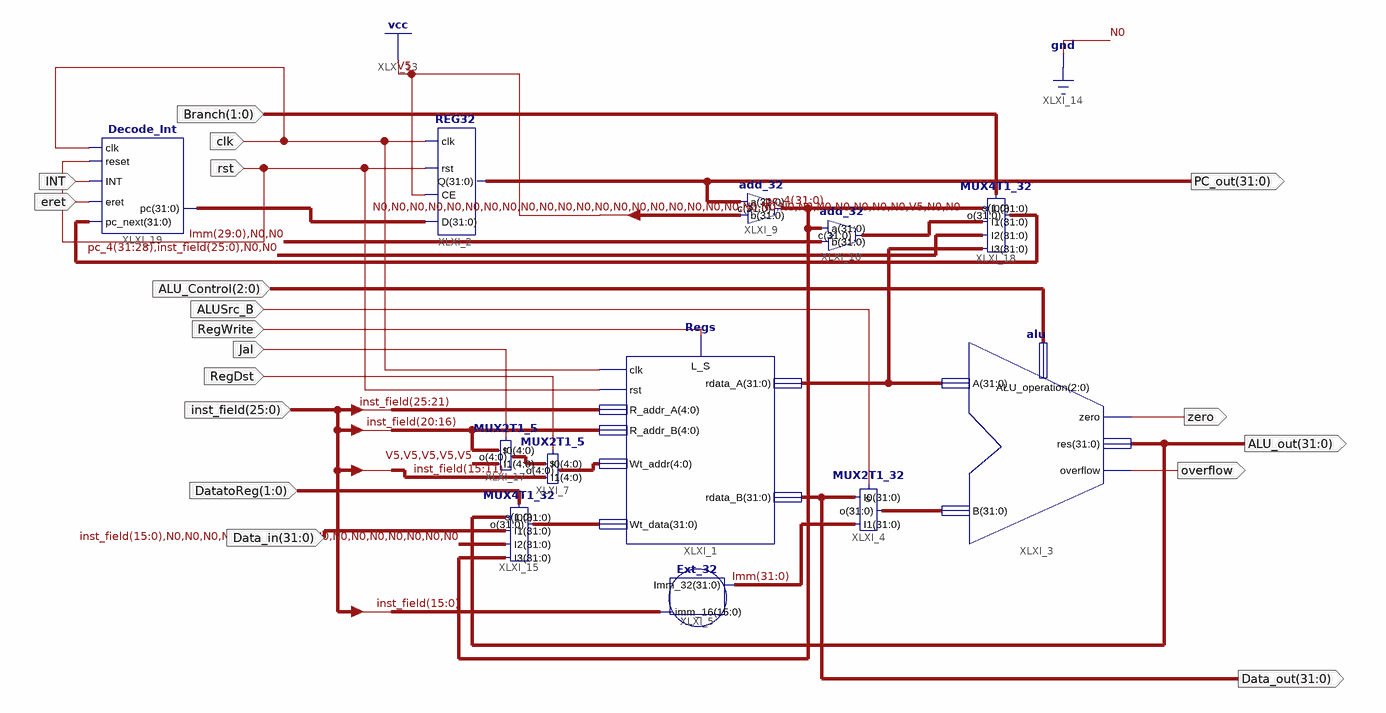
[diagram p0: schematic sheet 1]
// Xilinx ISE schematic Data_path_INT.sch (kintex7) as structural Verilog: 12 symbols, 18 ports
module Data_path_INT (
  input  [31:0] Data_in,
  input  [1:0] DatatoReg,
  input  [25:0] inst_field,
  input  RegDst,
  input  rst,
  input  clk,
  input  RegWrite,
  input  [2:0] ALU_Control,
  input  ALUSrc_B,
  input  Jal,
  input  [1:0] Branch,
  input  INT,
  input  eret,
  output [31:0] Data_out,
  output [31:0] ALU_out,
  output [31:0] PC_out,
  output zero,
  output overflow
);

  wire [4:0] XLXN_5, XLXN_59;
  wire [31:0] Imm, pc_4, XLXN_2, XLXN_4, XLXN_7, XLXN_41, XLXN_42, XLXN_61;

  Regs XLXI_1 (
    .clk(clk), .L_S(RegWrite), .rdata_A(XLXN_7), .rst(rst), .Wt_data(XLXN_4), .rdata_B(Data_out),
    .R_addr_A(inst_field[25:21]), .R_addr_B(inst_field[20:16]), .Wt_addr(XLXN_5));
  REG32 XLXI_2 (.D(XLXN_61), .CE(1'b1), .rst(rst), .clk(clk), .Q(PC_out));
  alu XLXI_3 (.zero(zero), .res(ALU_out), .overflow(overflow), .A(XLXN_7), .B(XLXN_2), .ALU_operation(ALU_Control));
  MUX2T1_32 XLXI_4 (.s(ALUSrc_B), .I0(Data_out), .I1(Imm), .o(XLXN_2));
  Ext_32 XLXI_5 (.imm_16(inst_field[15:0]), .Imm_32(Imm));
  MUX2T1_5 XLXI_7 (.I1(inst_field[15:11]), .I0(XLXN_59), .o(XLXN_5), .s(RegDst));
  add_32 XLXI_9 (.c(pc_4), .a(PC_out), .b(32'b00000000000000000000000000000100));
  add_32 XLXI_10 (.c(XLXN_41), .a(pc_4), .b({Imm[29:0], 2'b00}));
  MUX4T1_32 XLXI_15 (
    .s(DatatoReg), .I0(ALU_out), .I1(Data_in), .I2({inst_field[15:0], {16{1'b0}}}), .I3(pc_4), .o(XLXN_4));
  MUX2T1_5 XLXI_17 (.I1({5{1'b1}}), .I0(inst_field[20:16]), .o(XLXN_59), .s(Jal));
  MUX4T1_32 XLXI_18 (
    .s(Branch), .I0(pc_4), .I1(XLXN_41), .I2({pc_4[31:28], inst_field, 2'b00}), .I3(XLXN_7), .o(XLXN_42));
  Decode_Int XLXI_19 (.pc_next(XLXN_42), .clk(clk), .reset(rst), .INT(INT), .eret(eret), .pc(XLXN_61));
endmodule
